# Altium schematic sheet flipflop.SchDoc
size Letter
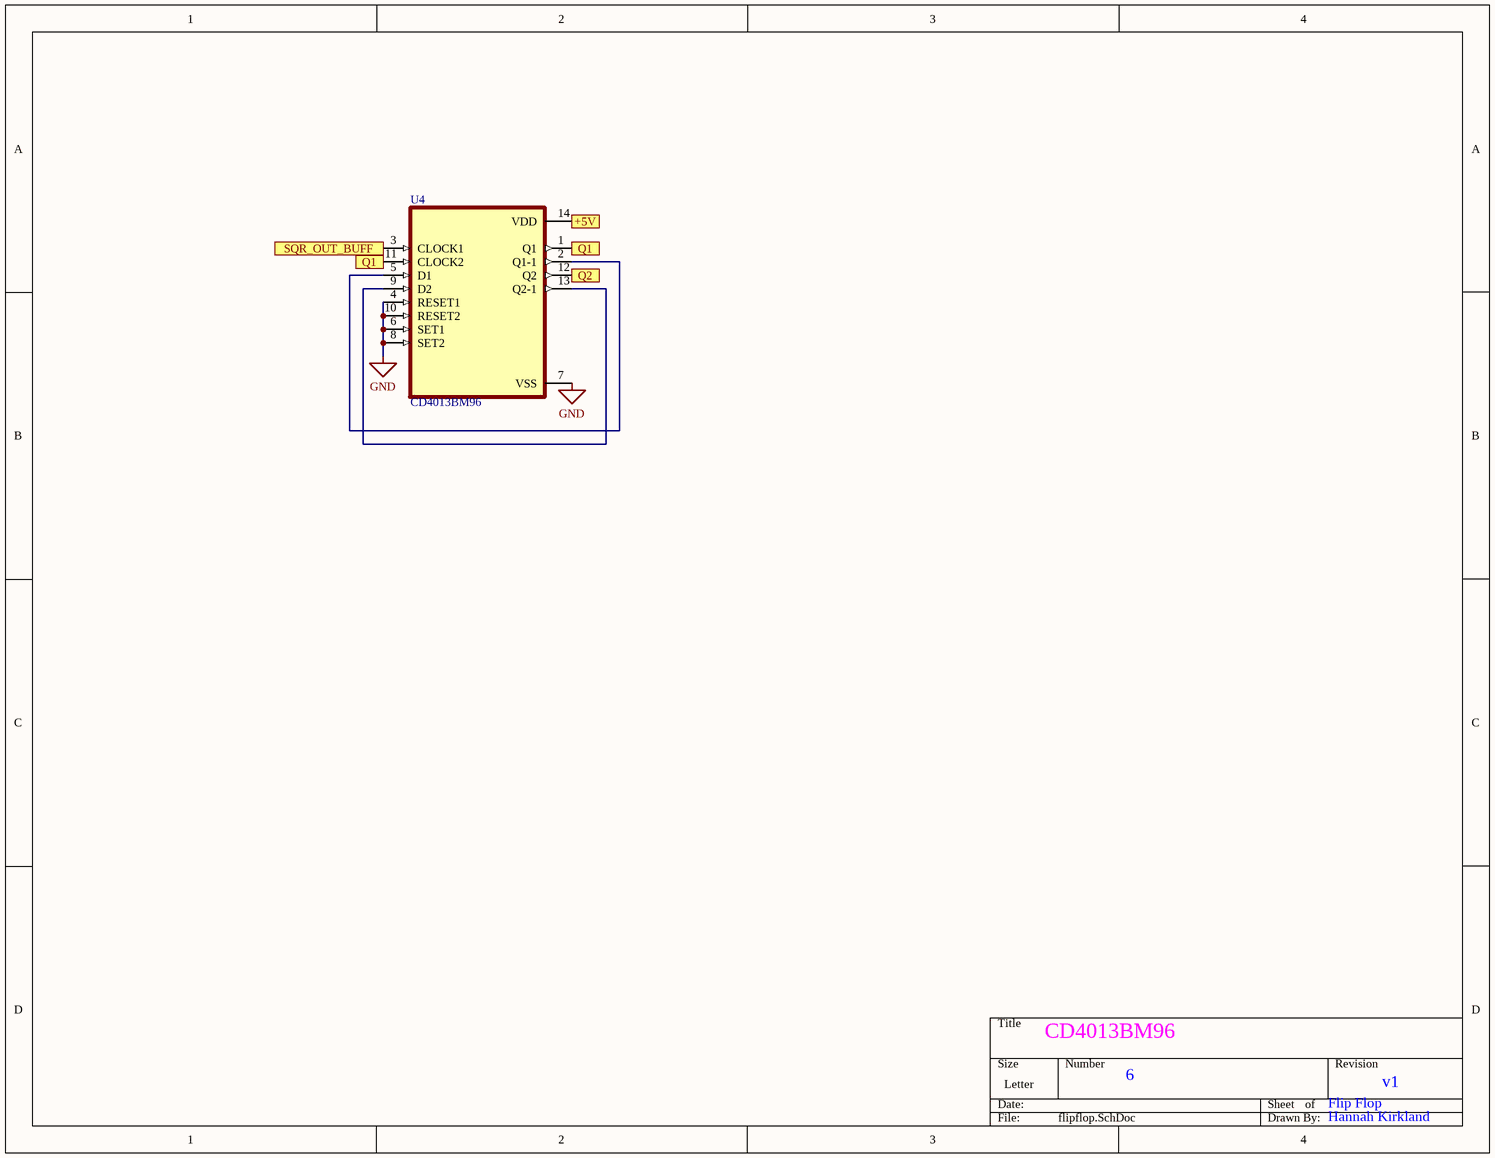
[diagram p0: flipflop.SchDoc]

## Parts
U4  CD4013BM96  [SOIC127P600X175-14N]

## Ports
+5V, Q1, Q2, SQR_OUT_BUFF

## Nets
GND: U4.4(RESET1) U4.6(SET1) U4.7(VSS) U4.8(SET2) U4.10(RESET2)
+5V: U4.14(VDD) ; port +5V
Q1: U4.1(Q1) U4.11(CLOCK2) ; port Q1
Q2: U4.12(Q2) ; port Q2
SQR_OUT_BUFF: U4.3(CLOCK1) ; port SQR_OUT_BUFF
NetU4_2: U4.2(Q1-1) U4.5(D1)
NetU4_9: U4.9(D2) U4.13(Q2-1)

## Notes on the sheet
- CD4013BM96
- 6
- Flip Flop
- v1
- Hannah Kirkland

## Library data of the parts
U4 = CD4013BM96: Package: None; Price: None; Value: *; MP: CD4013BM96; Availability: Unavailable